# EAGLE design AmbaSat-08-GPS_TESEO (EAGLE 9.5.1)
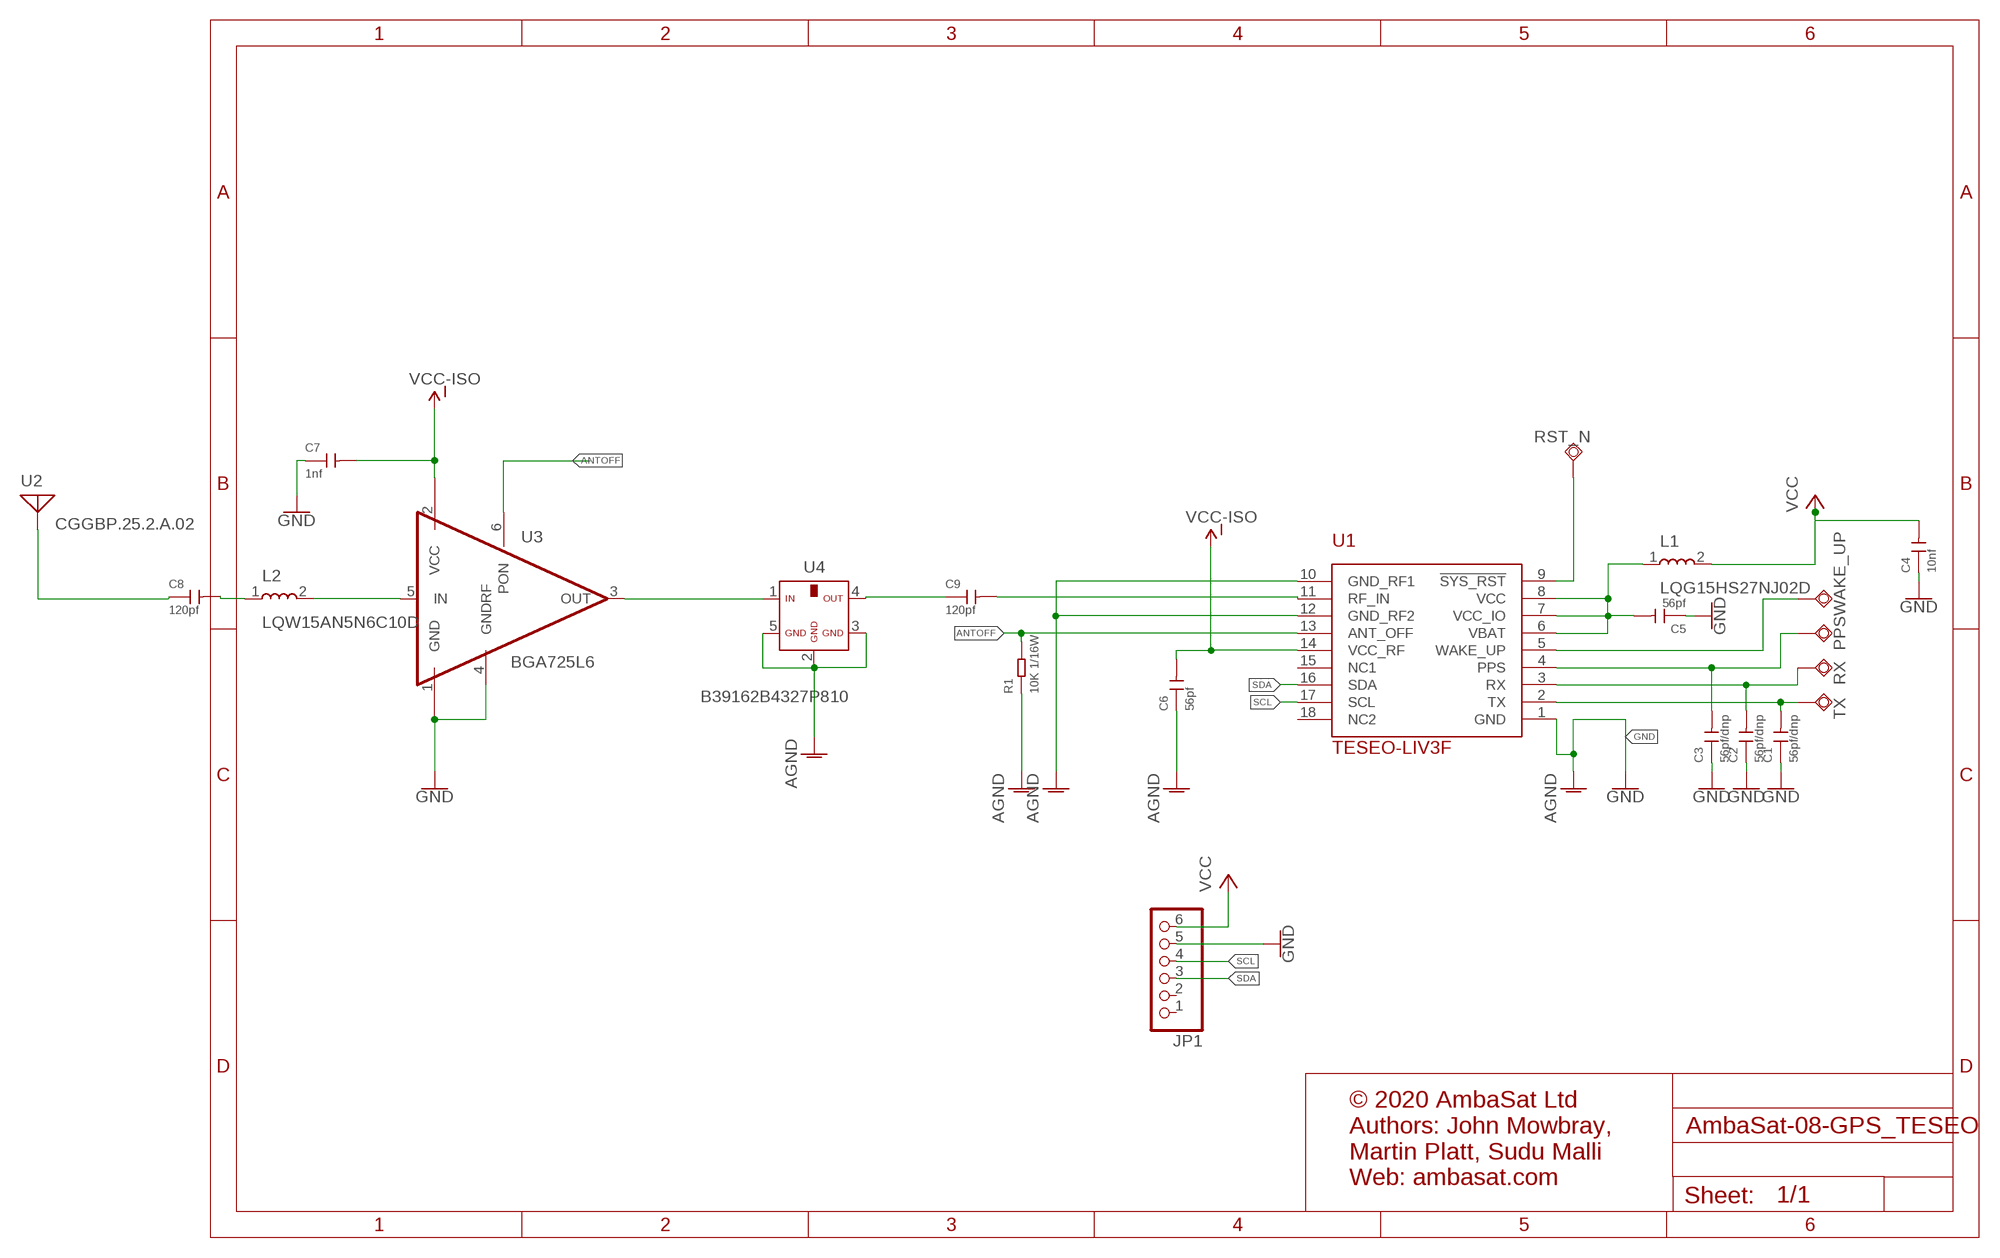
[diagram p0: schematic, sheet 1]

## Parts
C1  56pf/dnp  CERAMIC-100PF-50V-5%-NPO(0402)  [C0402]
C2  56pf/dnp  CERAMIC-100PF-50V-5%-NPO(0402)  [C0402]
C3  56pf/dnp  CERAMIC-100PF-50V-5%-NPO(0402)  [C0402]
C4  10nf  CERAMIC-10NF-50V-10%-X7R(0402)  [C0402]
C5  56pf  CERAMIC-100PF-50V-5%-NPO(0402)  [C0402]
C6  56pf  CERAMIC-100PF-50V-5%-NPO(0402)  [C0402]
C7  1nf  CERAMIC-1NF-50V-10%-X7R(0402)  [C0402]
C8  120pf  CERAMIC-100PF-50V-5%-NPO(0402)  [C0402]
C9  120pf  CERAMIC-100PF-50V-5%-NPO(0402)  [C0402]
JP1  HEADER-1X6  [1X06_OVAL]
L1  LQG15HS27NJ02D  LQG15HN2N2S02D  [LQG15HN2N2S02D]
L2  LQW15AN5N6C10D  LQG15HN2N2S02D  [LQG15HN2N2S02D]
PPS  TESTPAD_TPSQTP11SQ  [TESTPAD_TP11SQ]
R1  10K 1/16W  SMD-RES-10K-1%-1/16W(0402)  [R0402]
RST_N  TESTPAD_TPSQTP11SQ  [TESTPAD_TP11SQ]
RX  TESTPAD_TPSQTP11SQ  [TESTPAD_TP11SQ]
TX  TESTPAD_TPSQTP11SQ  [TESTPAD_TP11SQ]
U1  TESEO-LIV3F  [TESEO-LIV3F]
U2  CGGBP.25.2.A.02  [ANTENNA-PATCH]
U3  BGA725L6  [PSON35P100X100X35-6N]
U4  B39162B4327P810  [FIL_B39162B9417K610]
WAKE_UP  TESTPAD_TPSQTP11SQ  [TESTPAD_TP11SQ]

## Nets
ANTOFF: R1.2 U1.13(ANT_OFF) U3.6(PON)
GND: C1.1 C2.1 C3.1 C4.1 C5.1 C6.1 C7.1 JP1.5 R1.1 U1.1(GND) U1.10(GND_RF1) U1.12(GND_RF2) U3.1(GND) U3.4(GNDRF) U4.2(GND3) U4.3(GND2) U4.5(GND) ; supply symbol labelled AGND
N$1: C1.2 TX.TP U1.2(TX)
N$2: C2.2 RX.TP U1.3(RX)
N$3: C3.2 PPS.TP U1.4(PPS)
N$4: U1.5(WAKE_UP) WAKE_UP.TP
N$5: C5.2 L1.1 U1.6(VBAT) U1.7(VCC_IO) U1.8(VCC)
N$6: RST_N.TP U1.9(!SYS_RST)
N$7: L2.2 U3.5(IN)
N$8: C8.2 L2.1
N$9: C9.1 U4.4(OUT)
N$10: C9.2 U1.11(RF_IN)
N$11: C8.1 U2.ANT
N$13: U3.3(OUT) U4.1(IN)
SCL: JP1.4 U1.17(SCL)
SDA: JP1.3 U1.16(SDA)
VCC: C4.2 JP1.6 L1.2
VCC-ISO: C6.2 C7.2 U1.14(VCC_RF) U3.2(VCC)
Unconnected: JP1.1 JP1.2 U1.15(NC1) U1.18(NC2)

## Notes on the sheet
- © 2020 AmbaSat Ltd
  Authors: John Mowbray, 
  Martin Platt, Sudu Malli
  Web: ambasat.com

## Library data of the parts
C1-C3 C5 C6 = Seeed-Capacitor:CERAMIC-100PF-50V-5%-NPO(0402): 302010012; MPN: CC0402JRNPO9BN560; VALUE: 100pf
C4 = Seeed-Capacitor:CERAMIC-10NF-50V-10%-X7R(0402): 302010006; MPN: CC0402KRX7R9BB103
C7 = Seeed-Capacitor:CERAMIC-1NF-50V-10%-X7R(0402): 302010005; MPN: CC0402KRX7R9BB102
C8 C9 = Seeed-Capacitor:CERAMIC-100PF-50V-5%-NPO(0402): 302010012; MPN: CC0402JRNPO9BN121; VALUE: 100pf
JP1 = microbuilder:HEADER-1X6: PIN HEADER
L1 = Thermistor_Inductors:LQG15HN2N2S02D: FIXED IND 2.2NH 900MA 150 MOHM Manufacturer's datasheet <https://search.murata.co.jp/Ceramy/image/img/P02/JELF243B-0009.pdf>; CREATED_BY: PCBLayout.com; DIGIKEY_PART_NUMBER: 490-2628-1-ND; MANUFACTURER: Murata Electronics North America; MPN: LQG15HS27NJ02D; PACKAGE: 0402
L2 = Thermistor_Inductors:LQG15HN2N2S02D: FIXED IND 2.2NH 900MA 150 MOHM Manufacturer's datasheet <https://search.murata.co.jp/Ceramy/image/img/P02/JELF243B-0009.pdf>; CREATED_BY: PCBLayout.com; DIGIKEY_PART_NUMBER: 490-6833-1-ND; MANUFACTURER: Murata Electronics North America; MPN: LQW15AN5N6C10D; PACKAGE: 0402
PPS RST_N RX TX WAKE_UP = BeagleBone_Blue_R3:TESTPAD_TPSQ: Test pad
R1 = Seeed-Resistor:SMD-RES-10K-1%-1/16W(0402): 301010047; MPN: RC0402FR-0710KL
U1 = chiptron_cz:TESEO-LIV3F: Teseo-LIV3F
U2 = CGGBP.25.2.A.02:CGGBP.25.2.A.02; DIGIKEY-PN: 931-CGGBP.25.2.A.02-ND; MPN: CGGBP.25.2.A.02
U3 = PSON35P100X100X35-6N:BGA725L6: Silicon Germanium Low Noise Amplifier for Global Navigation Satellite Systems (GNSS) in ultra small package with 0.77mm² footprint; DIGIKEY: BGA725L6E6327FTSA1CT-ND; MPN: BGA725L6E6327FTSA1
U4 = FIL_B39162B9417K610:B39162B4327P810: SAW RF filter GPS + COMPASS + GLONASS; DIGIKEY: 495-7424-1-ND; MPN: B39162B4327P810

## Board
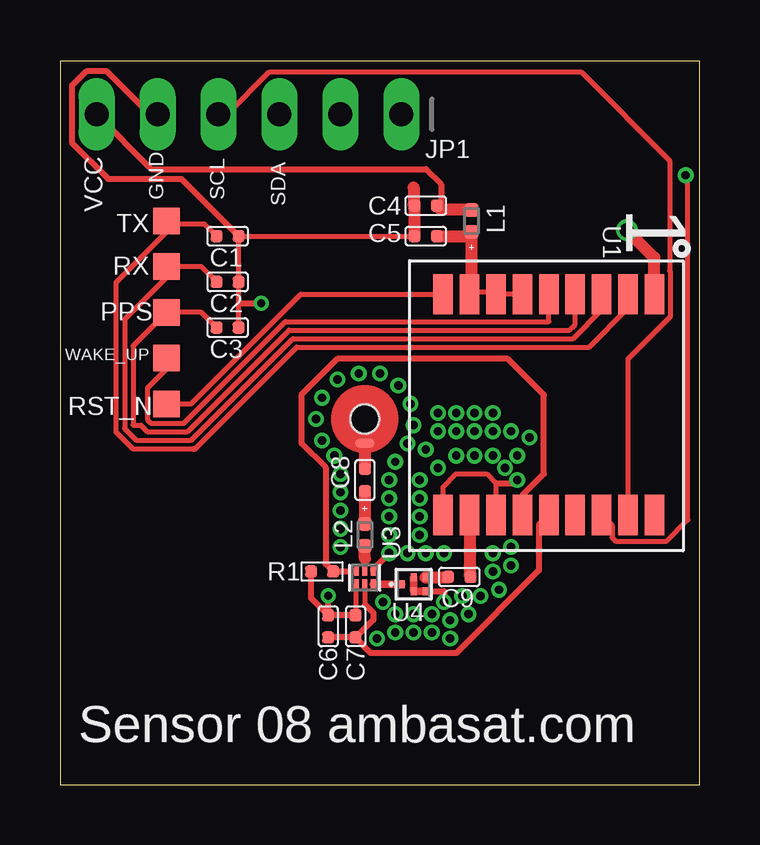
[diagram p1: board, top side]
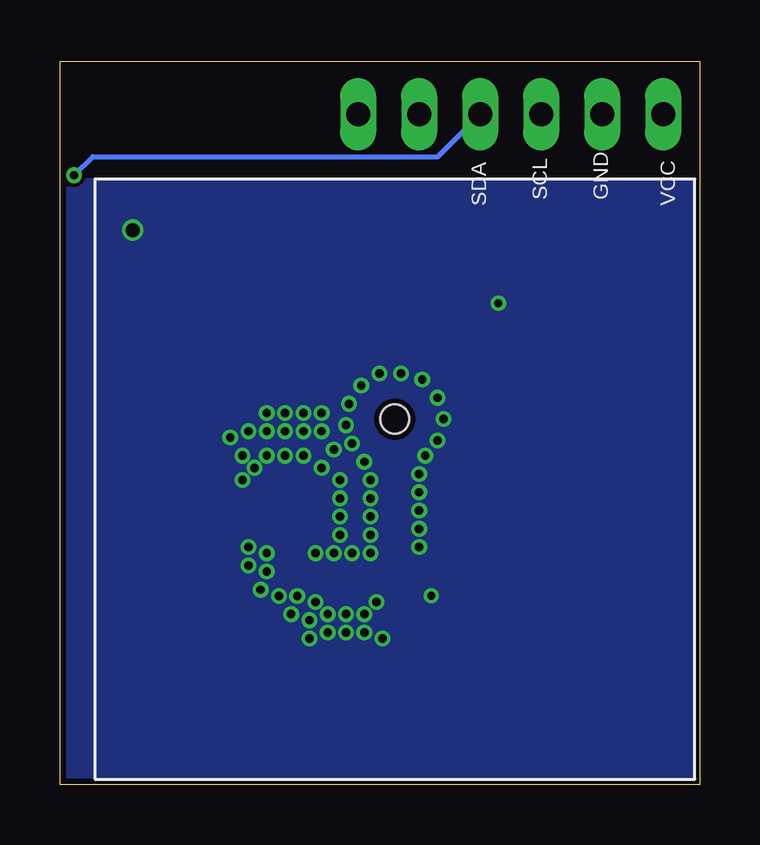
[diagram p2: board, bottom side, seen from below]

Size 26.65 x 30.15 mm. Coordinates in mm from the lower left corner, seen from the top.
Outline: 0,0 26.65,0 26.65,30.15 0,30.15 0,0
Copper layers (1*16): Top 0.035mm / dielectric 1.5mm / Bottom 0.035mm
Design rules "SeeedStudio_2layer_DRU_no_angle_20140221": minimum track width 6mil, minimum drill 12mil, track to track 6mil, track to pad 6mil, pad to pad 6mil, via to via 6mil, smd to smd 0mil, copper to edge 10mil, drill to drill 10mil, minimum pad ring 10mil, minimum via ring 6mil, stop-mask expansion 2mil, vias tented up to drill 100mil, thermal gap 10mil

### Footprints (pad centres in the part's own frame; a part is rotated, then mirrored left to right if it is on the bottom)
C0402 = smd 0.5 x 0.5: 1 0,0.463; 2 0,-0.463
1X06_OVAL = drill 1 long: 1 -6.35,0; 2 -3.81,0; 3 -1.27,0; 4 1.27,0; 5 3.81,0; 6 6.35,0
LQG15HN2N2S02D = smd 0.58 x 0.58: 1 -0.46,0; 2 0.46,0
TESTPAD_TP11SQ = smd 1.1 x 1.1: TP 0,0
R0402 = smd 0.5 x 0.5: 1 0,0.463; 2 0,-0.463
TESEO-LIV3F = smd 0.813 x 1.676: 1 0,0; 2 -1.1,0; 3 -2.2,0; 4 -3.3,0; 5 -4.4,0; 6 -5.5,0; 7 -6.6,0; 8 -7.7,0; 9 -8.8,0; 10 -8.8,-9.2; 11 -7.7,-9.2; 12 -6.6,-9.2; 13 -5.5,-9.2; 14 -4.4,-9.2; 15 -3.3,-9.2; 16 -2.2,-9.2; 17 -1.1,-9.2; 18 0,-9.2
ANTENNA-PATCH = smd 0.813 x 0.406: ANT 0,1.016 | hole 1.2: 0,0
PSON35P100X100X35-6N = smd 0.4 x 0.2: 1 -0.275,0.35; 2 -0.275,0; 3 -0.275,-0.35; 4 0.275,-0.35; 5 0.275,0; 6 0.275,0.35
FIL_B39162B9417K610 = smd 0.25 x 0.325: 1 -0.5,0; 2 0,-0.287; 3 0.5,-0.287; 4 0.5,0.287; 5 0,0.287

### Placement (x,y rotation side)
C1  6.99,22.86 270 top
C2  6.99,20.95 270 top
C3  6.99,19.05 270 top
C4  15.24,24.13 90 top
C5  15.24,22.86 90 top
C6  11.18,6.6 0 top
C7  12.32,6.6 0 top
C8  12.7,12.7 0 top
C9  16.64,8.66 90 top
JP1  7.87,27.94 180 top
L1  17.14,23.5 90 top
L2  12.7,10.41 270 top
PPS  4.45,19.68 180 top
R1  10.92,8.89 90 top
RST_N  4.45,15.88 180 top
RX  4.45,21.59 180 top
TX  4.45,23.5 180 top
U1  24.77,20.45 0 top
U2  12.7,15.24 180 top
U3  12.7,8.64 90 top
U4  14.73,8.36 0 top
WAKE_UP  4.45,17.78 180 top

### Tracks (layer width: path | path; a pad name or v marks a point on that pad's centre or on a via)
ANTOFF
  Top 0.203: U3.6 12.32,8.91
  Top 0.254: U1.13 19.27,12.06 20.16,12.96 20.16,16.25 18.67,17.75 11.56,17.75 10.06,16.25 10.06,14.23 11.06,13.22 11.06,9.21 R1.2 12.3,8.89 12.32,8.91
GND  (via drill 0.33, 0.35, 0.58)
  Top 0.203: U3.1 12.32,8.33 C7.1 | C3.1 7.45,20.07 C2.1 C1.1 C5.1 | U1.10 15.96,12.41 16.51,12.95 17.78,12.95 18.16,12.57 U1.12
  Top 0.254: C6.1 10.46,7.78 R1.1 | 7.45,20.07 v8.38,20.07 | 18.16,12.57 19.05,12.57 v19.05,12.7 | U4.3 16,8.07 v16,7.62 | C7.1 C6.1 | C6.1 v11.18,7.87 | U3.4 13.05,8.99 v13.72,9.65 | C1.1 5.06,25.25 2,25.25 0.49,26.76 0.49,29.12 1.1,29.73 1.95,29.73 3.74,27.94 JP1.5
  Top 0.305: U4.5 U4.2 U4.3
  Top 0.508: C5.1 C4.1 14.73,24.18 14.73,24.89 | U1.1 24.77,21.97 v23.62,23.11
  other vias: 12.45,17.14 11.56,16.89 10.92,16.13 10.67,15.24 10.92,14.35 13.34,17.14 14.1,16.64 14.61,15.88 14.73,14.99 14.48,14.22 13.97,13.46 11.43,13.72 11.68,12.95 13.72,12.7 11.68,12.19 13.72,11.94 11.68,11.43 13.72,11.18 11.68,10.67 13.72,10.41 11.68,9.91 14.48,9.65 15.24,9.65 16,9.65 14.99,10.41 14.99,11.18 14.99,11.94 14.99,12.7 15.75,13.21 16.51,13.72 17.27,13.72 18.03,13.72 18.54,13.21 18.8,9.91 18.8,9.14 19.56,14.48 15.24,13.97 19.05,13.72 13.46,7.62 13.97,7.11 14.73,7.11 15.49,7.11 16.76,7.87 18.03,9.65 18.03,8.89 17.53,7.87 18.29,8.13 13.97,6.35 14.73,6.35 15.49,6.35 16.26,6.86 17.02,7.11 16.26,6.1 13.21,6.1 17.27,14.73 16.51,14.73 18.03,14.73 18.03,15.49 17.27,15.49 16.51,15.49 18.8,14.73 15.75,14.73 15.75,15.49
  pour Bottom: 0,25.15 26.67,25.15 26.67,0 0,0
N$1
  Top 0.203: U1.2 23.66,19.86 22.05,18.24 9.86,18.24 5.59,13.97 5.55,14 3.02,14 2.34,14.69 2.34,20.94 4.45,23.05 4.45,23.37 | 4.45,23.37 TX.TP | C1.2 6.01,23.37 4.45,23.37
N$2
  Top 0.203: U1.3 22.61,20.41 22.61,19.81 22.6,19.81 21.38,18.59 9.7,18.59 5.47,14.36 3.17,14.36 2.69,14.84 2.69,19.39 4.45,21.14 RX.TP 5.89,21.59 C2.2
N$3
  Top 0.203: U1.4 21.46,19.18 21.34,19.05 21.33,19.05 21.23,18.95 9.55,18.95 5.32,14.71 3.64,14.71 3.37,14.99 3.05,14.99 3.05,18.29 PPS.TP 5.89,19.68 C3.2
N$4
  Top 0.203: WAKE_UP.TP 4.45,17.33 3.64,16.53 3.64,15.22 3.79,15.07 5.16,15.07 9.39,19.3 20.36,19.3 U1.5
N$5
  Top 0.203: U1.6 U1.7 18.09,20.53 17.14,20.53
  Top 0.508: L1.1 17.14,22.86 | 17.14,22.86 17.14,20.53 U1.8 | C5.2 17.14,22.86
N$6
  Top 0.203: RST_N.TP 5.46,15.88 10.03,20.45 U1.9
N$7
  Top 0.203: U3.5 12.7,9.44
  Top 0.508: 12.7,9.44 L2.2
N$8
  Top 0.508: C8.2 L2.1
N$9
  Top 0.508: U4.4 16.16,8.64 C9.1
N$10
  Top 0.508: C9.2 17.1,11.21 U1.11
N$11
  Top 0.508: U2.ANT C8.1
N$13
  Top 0.203: U3.3
  Top 0.305: U3.3 U4.1
SCL
  Top 0.203: U1.17 23.66,17.74 25.43,19.5 25.43,21.39 25.4,21.42 25.4,26.01 21.71,29.7 8.73,29.7 6.96,27.94 JP1.4
SDA  (via drill 0.35)
  Top 0.203: U1.16 23,10.81 23,10.3 23.15,10.15 25.28,10.15 26.16,11.04 26.16,25.4 v26.07,25.4
  Bottom 0.203: v26.07,25.4 25.29,26.18 10.91,26.18 JP1.3
VCC
  Top 0.254: JP1.6 3.81,25.65 15.24,25.65 15.88,25.02 15.88,23.95
  Top 0.508: L1.2 15.88,23.95 C4.2
VCC-ISO
  Top 0.203: U3.2 12.7,7.52
  Top 0.254: 12.7,7.52 13.06,7.16 13.06,6.88 C7.2 | C7.2 C6.2 | U1.14 19.95,10.83 19.95,8.93 16.51,5.49 12.96,5.49 12.6,5.84 12.6,5.86 C7.2

### Text on the board
tPlace: VCC | GND | SCL | SDA | Sensor 08 ambasat.com
bPlace: VCC | GND | SCL | SDA